# EAGLE design Xonik Noise A6 w.logo (EAGLE 6.5.0)
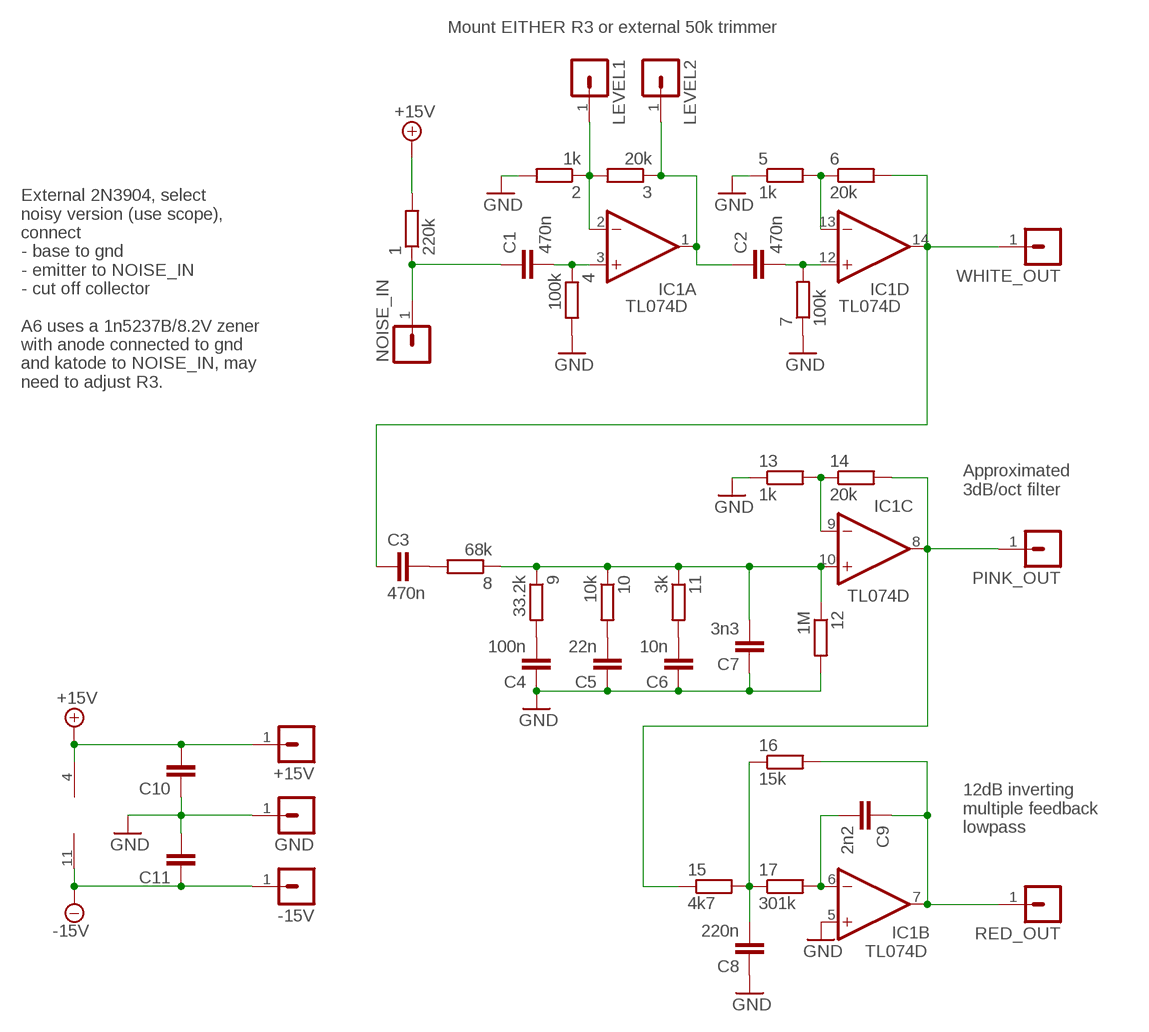
[diagram p0: schematic, sheet 1]

## Parts
1  220k  R-EU_R0805  [R0805]
2  1k  R-EU_R0805  [R0805]
3  20k  R-EU_R0805  [R0805]
4  100k  R-EU_R0805  [R0805]
5  1k  R-EU_R0805  [R0805]
6  20k  R-EU_R0805  [R0805]
7  100k  R-EU_R0805  [R0805]
8  68k  R-EU_R0805  [R0805]
9  33.2k  R-EU_R0805  [R0805]
10  10k  R-EU_R0805  [R0805]
11  3k  R-EU_R0805  [R0805]
12  1M  R-EU_R0805  [R0805]
13  1k  R-EU_R0805  [R0805]
14  20k  R-EU_R0805  [R0805]
15  4k7  R-EU_R0805  [R0805]
16  15k  R-EU_R0805  [R0805]
17  301k  R-EU_R0805  [R0805]
+15V  MA01-1JP  [SIP-PIN01-1J]
-15V  MA01-1JP  [SIP-PIN01-1J]
C1  470n  C-EUC0805  [C0805]
C2  470n  C-EUC0805  [C0805]
C3  470n  C-EUC0805  [C0805]
C4  100n  C-EUC0805  [C0805]
C5  22n  C-EUC0805  [C0805]
C6  10n  C-EUC0805  [C0805]
C7  3n3  C-EUC0805  [C0805]
C8  220n  C-EUC0805  [C0805]
C9  2n2  C-EUC0805  [C0805]
C10  C-EUC0603  [C0603]
C11  C-EUC0603  [C0603]
GND  MA01-1JP  [SIP-PIN01-1J]
IC1  TL074D  [SO14]
LEVEL1  MA01-1JP  [SIP-PIN01-1J]
LEVEL2  MA01-1JP  [SIP-PIN01-1J]
NOISE_IN  MA01-1JP  [SIP-PIN01-1J]
PINK_OUT  MA01-1JP  [SIP-PIN01-1J]
RED_OUT  MA01-1JP  [SIP-PIN01-1J]
WHITE_OUT  MA01-1JP  [SIP-PIN01-1J]

## Nets
+15V: 1.2 +15V.1 C10.2 IC1.4(P:V+)
-15V: -15V.1 C11.1 IC1.11(P:V-)
GND: 2.2 4.2 5.1 7.1 12.2 13.1 C4.1 C5.1 C6.1 C7.1 C8.1 C10.1 C11.2 GND.1 IC1.5(B:+IN)
N$1: 2.1 3.2 IC1.2(A:-IN) LEVEL1.1
N$2: 5.2 6.1 IC1.13(D:-IN)
N$3: 13.2 14.1 IC1.9(C:-IN)
N$4: 9.2 C4.2
N$5: 10.2 C5.2
N$6: 11.2 C6.2
N$7: 1.1 C1.1 NOISE_IN.1
N$8: 4.1 C1.2 IC1.3(A:+IN)
N$9: 3.1 C2.1 IC1.1(A:OUT) LEVEL2.1
N$10: 7.2 C2.2 IC1.12(D:+IN)
N$11: 6.2 C3.1 IC1.14(D:OUT) WHITE_OUT.1
N$12: 8.1 9.1 10.1 11.1 12.1 C7.2 IC1.10(C:+IN)
N$13: 8.2 C3.2
N$14: 14.2 15.1 IC1.8(C:OUT) PINK_OUT.1
N$16: 15.2 16.1 17.1 C8.2
N$17: 17.2 C9.2 IC1.6(B:-IN)
N$18: 16.2 C9.1 IC1.7(B:OUT) RED_OUT.1

## Notes on the sheet
- Mount EITHER R3 or external 50k trimmer
- External 2N3904, select
  noisy version (use scope),
  connect 
  - base to gnd
  - emitter to NOISE_IN
  - cut off collector
  
  A6 uses a 1n5237B/8.2V zener
  with anode connected to gnd 
  and katode to NOISE_IN, may
  need to adjust R3.
- Approximated
  3dB/oct filter
- 12dB inverting
  multiple feedback
  lowpass

## Library data of the parts
1-17 = resistor:R-EU_: RESISTOR, European symbol
+15V -15V GND LEVEL1 LEVEL2 NOISE_IN PINK_OUT RED_OUT WHITE_OUT = joakim:MA01-1J: PIN HEADER
C1-C11 = resistor:C-EU: CAPACITOR, European symbol
IC1 = linear:TL074: OP AMP

## Board
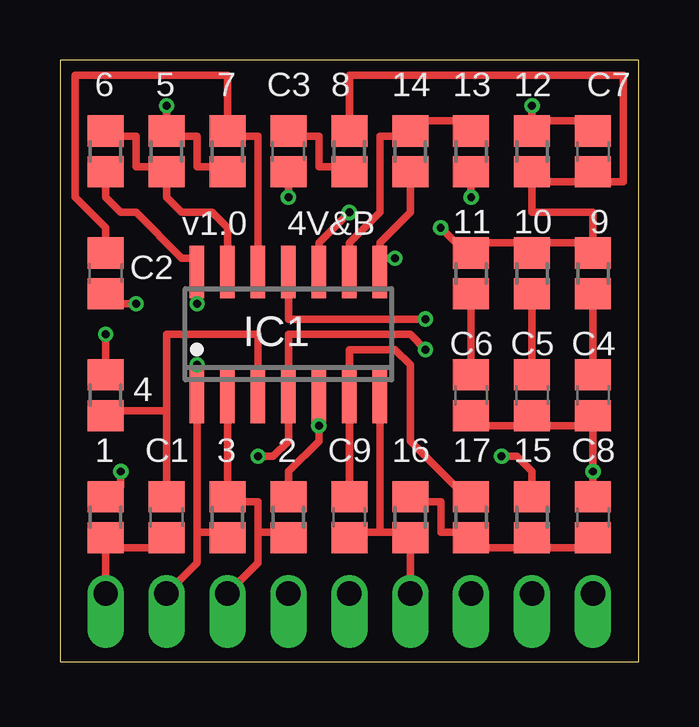
[diagram p1: board, top side]
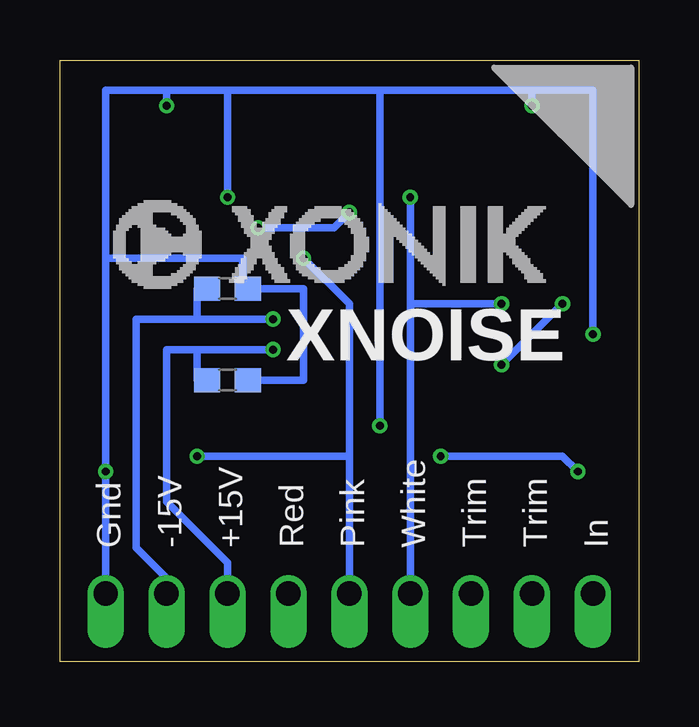
[diagram p2: board, bottom side, seen from below]

Size 24.13 x 25.08 mm. Coordinates in mm from the lower left corner, seen from the top.
Outline: 0,0 24.13,0 24.13,25.08 0,25.08 0,0
Copper layers (1*16): Top 0.035mm / dielectric 1.5mm / Bottom 0.035mm
Design rules "dirt_cheap_dirty_boards.v1": minimum track width 5mil, minimum drill 12mil, track to track 5mil, track to pad 5mil, pad to pad 5mil, via to via 5mil, smd to smd 0mil, copper to edge 10mil, drill to drill 10mil, minimum pad ring 10mil, minimum via ring 6mil, stop-mask expansion 2mil, vias tented up to drill 25mil, thermal gap 10mil

### Footprints (pad centres in the part's own frame; a part is rotated, then mirrored left to right if it is on the bottom)
R0805 = smd 1.3 x 1.5: 1 -0.85,0; 2 0.85,0
SIP-PIN01-1J = drill 1.016 offset: 1 0,0
C0805 = smd 1.3 x 1.5: 1 -0.85,0; 2 0.85,0
C0603 = smd 1.1 x 1: 1 -0.85,0; 2 0.85,0
SO14 = smd 0.6 x 2.2: 1 -3.81,-2.6; 2 -2.54,-2.6; 3 -1.27,-2.6; 4 0,-2.6; 5 1.27,-2.6; 6 2.54,-2.6; 7 3.81,-2.6; 8 3.81,2.6; 9 2.54,2.6; 10 1.27,2.6; 11 0,2.6; 12 -1.27,2.6; 13 -2.54,2.6; 14 -3.81,2.6

### Placement (x,y rotation side)
1  1.91,6.03 90 top
2  9.53,6.03 90 top
3  6.99,6.03 90 top
4  1.91,11.11 90 top
5  4.45,21.27 270 top
6  1.91,21.27 270 top
7  6.99,21.27 90 top
8  12.06,21.27 270 top
9  22.23,16.19 270 top
10  19.68,16.19 270 top
11  17.14,16.19 270 top
12  19.68,21.27 90 top
13  17.14,21.27 90 top
14  14.61,21.27 270 top
15  19.68,6.03 270 top
16  14.61,6.03 270 top
17  17.14,6.03 90 top
+15V  17.14,2.86 0 top
-15V  19.68,2.86 0 top
C1  4.45,6.03 90 top
C2  1.91,16.19 90 top
C3  9.53,21.27 90 top
C4  22.23,11.11 90 top
C5  19.68,11.11 90 top
C6  17.14,11.11 90 top
C7  22.23,21.27 270 top
C8  22.23,6.03 270 top
C9  12.06,6.03 90 top
C10  17.14,11.75 180 bottom
C11  17.14,15.56 0 bottom
GND  22.23,2.86 0 top
IC1  9.53,13.65 0 top
LEVEL1  6.99,2.86 0 top
LEVEL2  4.45,2.86 0 top
NOISE_IN  1.91,2.86 0 top
PINK_OUT  12.06,2.86 0 top
RED_OUT  14.61,2.86 0 top
WHITE_OUT  9.53,2.86 0 top

### Tracks (layer width: path | path; a pad name or v marks a point on that pad's centre or on a via)
+15V  (via drill 0.33)
  Top 0.305: v15.24,13.02 14.61,13.65 9.53,13.65 IC1.4 9.53,9.21 8.89,8.57 v8.26,8.57 | 1.2 2.12,6.88 2.54,7.3 v2.54,7.94
  Bottom 0.305: v15.24,13.02 18.41,13.02 | 18.41,13.02 19.68,13.02 19.68,6.67 17.14,4.13 +15V.1 | v2.54,7.94 3.17,8.57 v8.26,8.57 | C10.2 18.41,11.75 18.41,13.02
-15V  (via drill 0.33)
  Top 0.305: IC1.11 9.53,14.29 v15.24,14.29
  Bottom 0.305: v15.24,14.29 18.41,14.29 | 18.41,14.29 20.95,14.29 20.95,4.76 19.68,3.49 -15V.1 | C11.1 18.41,15.56 18.41,14.29
GND  (via drill 0.33)
  Top 0.305: 2.2 9.53,7.94 10.79,9.21 v10.79,9.84 IC1.5 | v4.45,23.18 5.1 4.45,21.91 5.71,21.91 5.71,20.64 6.77,20.64 7.1 | 2.33,12.38 4.2 v1.91,13.65 | C4.1 22.23,9.84 | 19.47,9.84 C5.1 19.68,9.84 | 19.68,9.84 19.47,9.84 | 19.47,9.84 17.57,9.84 | 17.57,9.84 C6.1 17.14,9.84 17.57,9.84 | v19.68,23.18 19.68,22.54 | 12.2 19.68,22.54 | 19.68,22.54 21.8,22.54 C7.1 | v17.14,19.37 13.1 | 19.68,9.84 22.23,9.84 | 22.23,9.84 v22.23,7.94 C8.1
  Bottom 0.305: 4.45,23.81 10.79,23.81 | 10.79,23.81 v10.79,9.84 | v4.45,23.18 4.45,23.81 | 4.45,23.81 1.91,23.81 v1.91,13.65 | 10.79,23.81 17.14,23.81 | 17.14,23.81 v17.14,19.37 | 17.14,23.81 19.68,23.81 | GND.1 v22.23,7.94 22.23,16.83 | 22.23,16.83 22.23,23.81 19.68,23.81 | 19.68,23.81 v19.68,23.18 | C10.1 13.97,11.75 13.97,15.56 C11.2 16.51,15.56 16.51,16.83 22.23,16.83
N$1
  Top 0.305: IC1.2 3.2 6.99,6.67 8.26,6.67 8.26,5.4 | 8.26,5.4 9.31,5.4 2.1 | LEVEL1.1 8.26,4.13 8.26,5.4
N$2
  Top 0.305: 6.1 1.91,21.91 3.17,21.91 3.17,20.64 4.23,20.64 5.2 4.45,19.37 5.08,18.73 6.35,18.73 6.99,18.1 IC1.13
N$3
  Top 0.305: IC1.9 12.06,17.46 13.34,18.73 13.34,21.91 14.39,21.91 14.1 14.61,22.54 16.73,22.54 13.2
N$4
  Top 0.305: C4.2 9.2
N$5
  Top 0.305: C5.2 10.2
N$6
  Top 0.305: C6.2 11.2
N$7
  Top 0.305: NOISE_IN.1 1.1 2.33,4.76 4.45,4.76 C1.1
N$8
  Top 0.305: C1.2 4.45,10.48 | 2.54,10.48 4.1 1.91,10.48 2.54,10.48 | 2.54,10.48 4.45,10.48 | 4.45,10.48 4.45,13.65 8.26,13.65 IC1.3
N$9  (via drill 0.33)
  Top 0.305: LEVEL2.1 5.71,4.13 5.71,5.4 | 5.71,5.4 IC1.1 v5.71,12.38 | 5.71,5.4 6.77,5.4 3.1 | v3.17,14.92 1.91,14.92 C2.1
  Bottom 0.305: v5.71,12.38 v3.17,14.92
N$10
  Top 0.305: IC1.12 8.26,21.91 7.2,21.91 7.2 6.99,24.45 0.64,24.45 0.64,19.37 1.91,18.1 C2.2
N$11  (via drill 0.33)
  Top 0.305: v5.71,14.92 IC1.14 5.71,16.83 5.08,16.83 3.17,18.73 2.54,18.73 1.91,19.37 6.2 | C3.1 v9.53,19.37
  Bottom 0.305: WHITE_OUT.1 9.53,14.92 | 9.53,14.92 v5.71,14.92 | v9.53,19.37 9.53,14.92
N$12  (via drill 0.33)
  Top 0.305: IC1.10 10.79,17.46 v12.06,18.73 | 8.1 12.06,24.45 23.5,24.45 23.5,20 22.64,20 C7.2 22.23,20 20.11,20 12.1 19.68,18.73 22.23,18.73 9.1 21.8,17.46 19.68,17.46 10.1 19.27,17.46 17.14,17.46 11.1 16.73,17.46 16.51,17.46 v15.88,18.1
  Bottom 0.305: v15.88,18.1 12.7,18.1 v12.06,18.73
N$13
  Top 0.305: 9.53,22.54 C3.2 9.53,21.91 10.79,21.91 10.79,20.64 11.85,20.64 8.2
N$14  (via drill 0.33)
  Top 0.305: IC1.8 13.34,17.46 14.61,18.73 14.2 | 15.1 19.68,7.94 19.05,8.57 v18.41,8.57 | v13.97,16.83 13.34,16.83 IC1.8 | 13.39,16.19 IC1.8
  Bottom 0.305: v18.41,8.57 12.06,8.57 | 12.06,8.57 12.06,14.92 v13.97,16.83 | PINK_OUT.1 12.06,8.57
N$16
  Top 0.305: 16.1 14.61,6.67 15.88,6.67 15.88,5.4 16.93,5.4 17.1 17.14,4.76 19.47,4.76 15.2 19.68,4.76 22.23,4.76 C8.2
N$17
  Top 0.305: C9.2 IC1.6 12.06,13.02 13.97,13.02 14.61,12.38 14.61,9.21 16.93,6.88 17.2
N$18
  Top 0.305: C9.1 12.06,5.4 13.34,5.4 | 13.34,5.4 14.61,5.4 16.2 RED_OUT.1 | IC1.7 13.34,5.4

### Text on the board
tNames: 6 | 5 | 7 | C3 | 8 | 14 | 13 | 12 | C7 | v1.0 | 4V&B | 11 | 10 | 9 | C2 | IC1 | C6 | C5 | C4 | 4 | 1 | C1 | 3 | 2 | C9 | 16 | 17 | 15 | C8
bNames: XNOISE | In | Trim | Trim | White | Pink | Red | +15V | -15V | Gnd